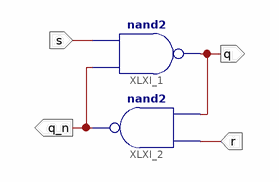
[diagram p0: schematic sheet 1]
// Xilinx ISE schematic sr_flop.sch (spartan3e) as structural Verilog: 2 symbols, 4 ports
module sr_flop (
  input  s,
  input  r,
  output q,
  output q_n
);

  nand XLXI_1 (q, q_n, s);
  nand XLXI_2 (q_n, q, r);
endmodule
